# EAGLE design custom (EAGLE 9.6.2)
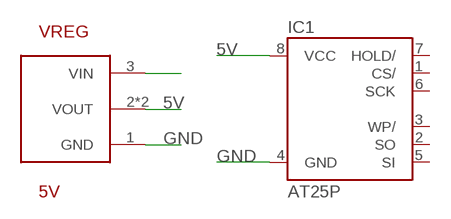
[diagram p0: schematic, sheet 1]

## Parts
IC1  AT25P  [DIL08]
VREG  5V  VOLTAGE-REGULATOR  [VOLTAGE-REGULATOR]

## Nets
5V: IC1.8(VCC) VREG.2(VOUT) VREG.2B(VOUT)
GND: IC1.4(GND) VREG.1(GND)
N$1: VREG.3(VIN)
Unconnected: IC1.1(CS/) IC1.2(SO) IC1.3(WP/) IC1.5(SI) IC1.6(SCK) IC1.7(HOLD/)

## Library data of the parts
IC1 = atmel:AT25*: SPI bus serial EEPROM; MPN: CAT25040LI-G; OC_FARNELL: 1718045; OC_NEWARK: 06R0588
VREG = my_lib:VOLTAGE-REGULATOR

## Board
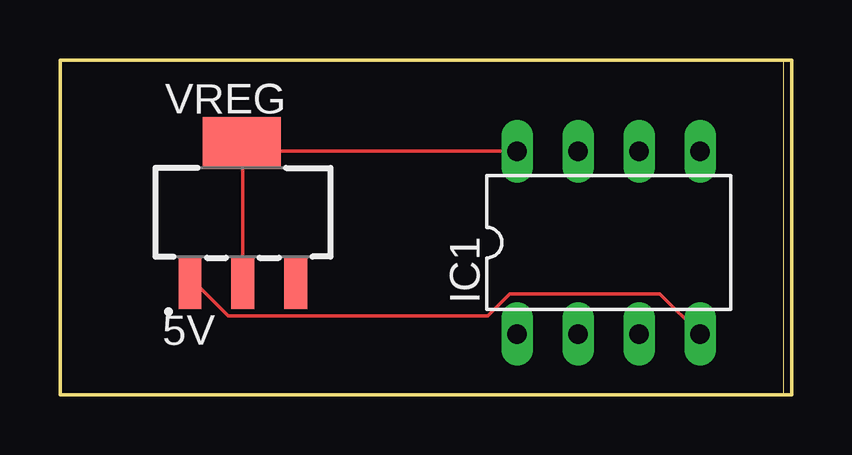
[diagram p1: board, top side]

Size 30.48 x 13.97 mm. Coordinates in mm from the lower left corner, seen from the top.
Outline: 0,0 30.15,0 30.15,13.96 0,13.96 0,0
Outline: 0,0 0,13.97 30.48,13.97 30.48,0 0,0
Copper layers (1*16): Top 0.035mm / dielectric 1.5mm / Bottom 0.035mm
Design rules "default": minimum track width 6mil, minimum drill 0.35mm, track to track 6mil, track to pad 6mil, pad to pad 6mil, via to via 6mil, smd to smd 6mil, copper to edge 40mil, drill to drill 6mil, minimum pad ring 10mil, minimum via ring 8mil, stop-mask expansion 4mil, vias tented up to drill 0mil, thermal gap 10mil

### Footprints (pad centres in the part's own frame; a part is rotated, then mirrored left to right if it is on the bottom)
DIL08 = drill 0.813 long: 1 -3.81,-3.81; 2 -1.27,-3.81; 3 1.27,-3.81; 4 3.81,-3.81; 5 3.81,3.81; 6 1.27,3.81; 7 -1.27,3.81; 8 -3.81,3.81
VOLTAGE-REGULATOR = smd 0.95 x 2.15: 1 -2.2,-2.95; 2 0,-2.95; 3 2.2,-2.95 | smd 3.25 x 2.15: 2B -0.05,2.9

### Placement (x,y rotation side)
IC1  22.86,6.35 0 top
VREG  7.62,7.62 0 top

### Tracks (layer width: path | path; a pad name or v marks a point on that pad's centre or on a via)
5V
  Top 0.152: 7.62,10.16 7.62,10.46 VREG.2B 7.62,10.16 | 7.62,10.16 VREG.2 | 7.62,10.16 IC1.8
GND
  Top 0.152: IC1.4 24.99,4.22 18.74,4.22 17.83,3.3 7.01,3.3 5.79,4.52 5.49,4.52 VREG.1